# Altium schematic sheet Gpio_RTC.SchDoc
size A4
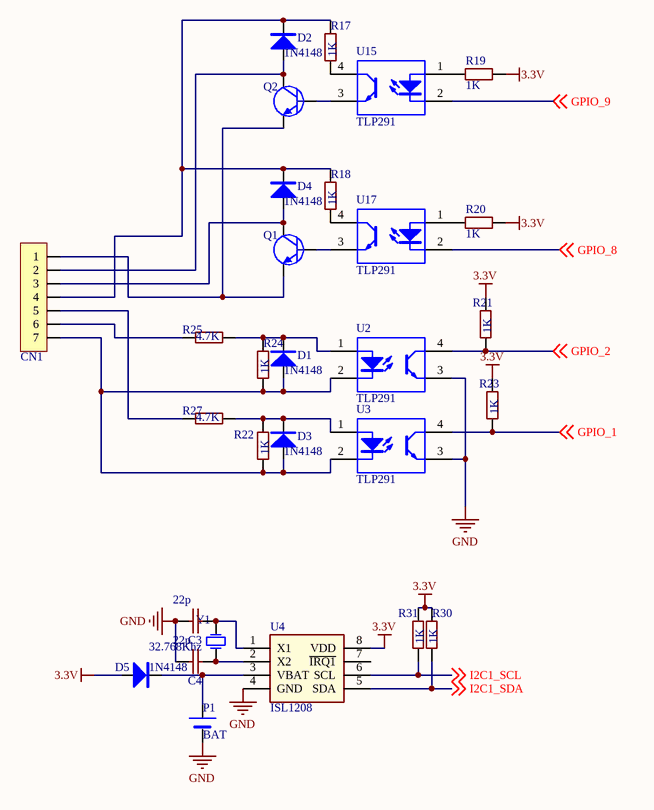
[diagram p0: Gpio_RTC.SchDoc]

## Parts
C3  22p  [0805SMD_Cap]
C4  22p  [0805SMD_Cap]
CN1  CON7  [WJ15EDGRM-3.81-7P]  (value not drawn)
D1  1N4148  [二极管SOD-123]
D2  1N4148  [二极管SOD-123]
D3  1N4148  [二极管SOD-123]
D4  1N4148  [二极管SOD-123]
D5  1N4148  [二极管SOD-123]
P1  BAT  [CR1220]
Q1  1318  [SOT-23]  (value not drawn)
Q2  1318  [SOT-23]  (value not drawn)
R17  1K  [0805_SMD_R]
R18  1K  [0805_SMD_R]
R19  1K  [0805_SMD_R]
R20  1K  [0805_SMD_R]
R21  1K  [0805_SMD_R]
R22  1K  [0805_SMD_R]
R23  1K  [0805_SMD_R]
R24  1K  [0805_SMD_R]
R25  4.7K  [0805_SMD_R]
R27  4.7K  [0805_SMD_R]
R30  1K  [0805_SMD_R]
R31  1K  [0805_SMD_R]
U2  TLP291  [sop-4]
U3  TLP291  [sop-4]
U4  ISL1208  [运放SO8]
U15  TLP291  [sop-4]
U17  TLP291  [sop-4]
Y1  32.768Khz  [XTAL_0503_2Pin]

## Nets
3.3V: D5.A R19.1 R20.1 R21.2 R23.2 R30.1 R31.1 U4.8(VDD)
GND: C3.1 C4.1 P1.2(-) U2.3 U3.3 U4.4(GND)
GPIO_1: R23.1 U3.4 ; off-sheet GPIO_1
GPIO_2: R21.1 U2.4 ; off-sheet GPIO_2
GPIO_8: U17.2 ; off-sheet GPIO_8
GPIO_9: U15.2 ; off-sheet GPIO_9
I2C1_SCL: R31.2 U4.6(SCL) ; off-sheet I2C1_SCL
I2C1_SDA: R30.2 U4.5(SDA) ; off-sheet I2C1_SDA
NetC3_2: C3.2 U4.1(X1) Y1.2(OSC2)
NetC4_2: C4.2 U4.2(X2) Y1.1(OSC1)
NetCN1_1: CN1.1 Q1.2(E) Q2.2(E)
NetCN1_2: CN1.2 D2.A Q2.3(C)
NetCN1_3: CN1.3 D4.A Q1.3(C)
NetCN1_4: CN1.4 D2.K D4.K R17.2 R18.2
NetCN1_5: CN1.5 R27.1
NetCN1_6: CN1.6 R25.1
NetCN1_7: CN1.7 D1.A D3.A R22.1 R24.1 U2.2 U3.2
NetD1_K: D1.K R24.2 R25.2 U2.1
NetD3_K: D3.K R22.2 R27.2 U3.1
NetD5_K: D5.K P1.1(+) U4.3(VBAT)
NetQ1_1: Q1.1(B) U17.3
NetQ2_1: Q2.1(B) U15.3
NetR17_1: R17.1 U15.4
NetR18_1: R18.1 U17.4
NetR19_2: R19.2 U15.1
NetR20_2: R20.2 U17.1

Not connected (* = marked no-connect by the designer): U4 7(~{IR}~{Q1})

## Library data of the parts
C3 C4 = SMD_Cap: 贴片电容; 研究所: 贴装电容_0805_0.1uF; 松下: GR21BB1H104K; 松下: GR21BB1H224K; 松下: GR21BB1H103K; 研究所: 贴装电容_0805_0.22uF; 研究所: 贴装电容_0805_0.01uF; 松下: GR21BB1H473K; 研究所: 贴装电容_0805_0.047uF; 松下: GR21BB1H300K; 研究所: 贴装电容_0805_30pF; 松下: GR21BB1H105K; 研究所: 贴装电容_0805_1uF; 松下: GR21BB1H472K; 研究所: 贴装电容_0805_4700pF
CN1 = CON7: 连接器; 松下: B6BXH2TV4
D1-D5 = DIODE: 二极管
Q1 Q2 = 三极管: Published: 8-Jun-2000; LatestRevisionDate: 17-Jul-2002; LatestRevisionNote: Re-released for DXP Platform.; PackageReference: TO-226; Publisher: Altium Limited; Code_JEDEC: TO-226-AA
R17-R25 R27 R30 R31 = SMD_0805: 贴片电阻; 松下: RS05K101FT; 松下: RS05000FT; 松下: RS05K3321FT; 松下: RS05K6811FT; 松下: RS05K102FT; 松下: RS05K2211FT; 松下: RS05K103FT; 松下: RS05K5111FT; 松下: RS05K5110FT; 松下: RS05K5112FT; 松下: RS05K8251FT; 松下: RS05K2212FT; 松下: RS05K104FT; 松下: RS05K5113FT; 松下: RS05K105FT; 松下: RS05L106FT; 研究所: 贴装电阻_0805_0_F1%; 研究所: 贴装电阻_0805_100_F1%; 研究所: 贴装电阻_0805_51.1K_F1%; 研究所: 贴装电阻_0805_1K_F1%; 研究所: 贴装电阻_0805_2.21K_F1%; 研究所: 贴装电阻_0805_3.32K_F1%; 研究所: 贴装电阻_0805_5.11K_F1%; 研究所: 贴装电阻_0805_511K_F1%; 研究所: 贴装电阻_0805_6.81K_F1%; 研究所: 贴装电阻_0805_511_F1%; 研究所: 贴装电阻_0805_8.25K_F1%; 研究所: 贴装电阻_0805_10K_F1%; 研究所: 贴装电阻_0805_22.1K_F1%; 研究所: 贴装电阻_0805_100K_F1%; 研究所: 贴装电阻_0805_1M_F1%; 研究所: 贴装电阻_0805_10M_F1%
U4 = ISL1208: 时钟芯片
Y1 = XTAL: 无源晶振贴装; Published: 8-Jun-2000; LatestRevisionDate: 17-Jul-2002; LatestRevisionNote: Re-released for DXP Platform.; PackageReference: R38; Publisher: Altium Limited